# EAGLE schematic TIMESQUARE (EAGLE 6.3)
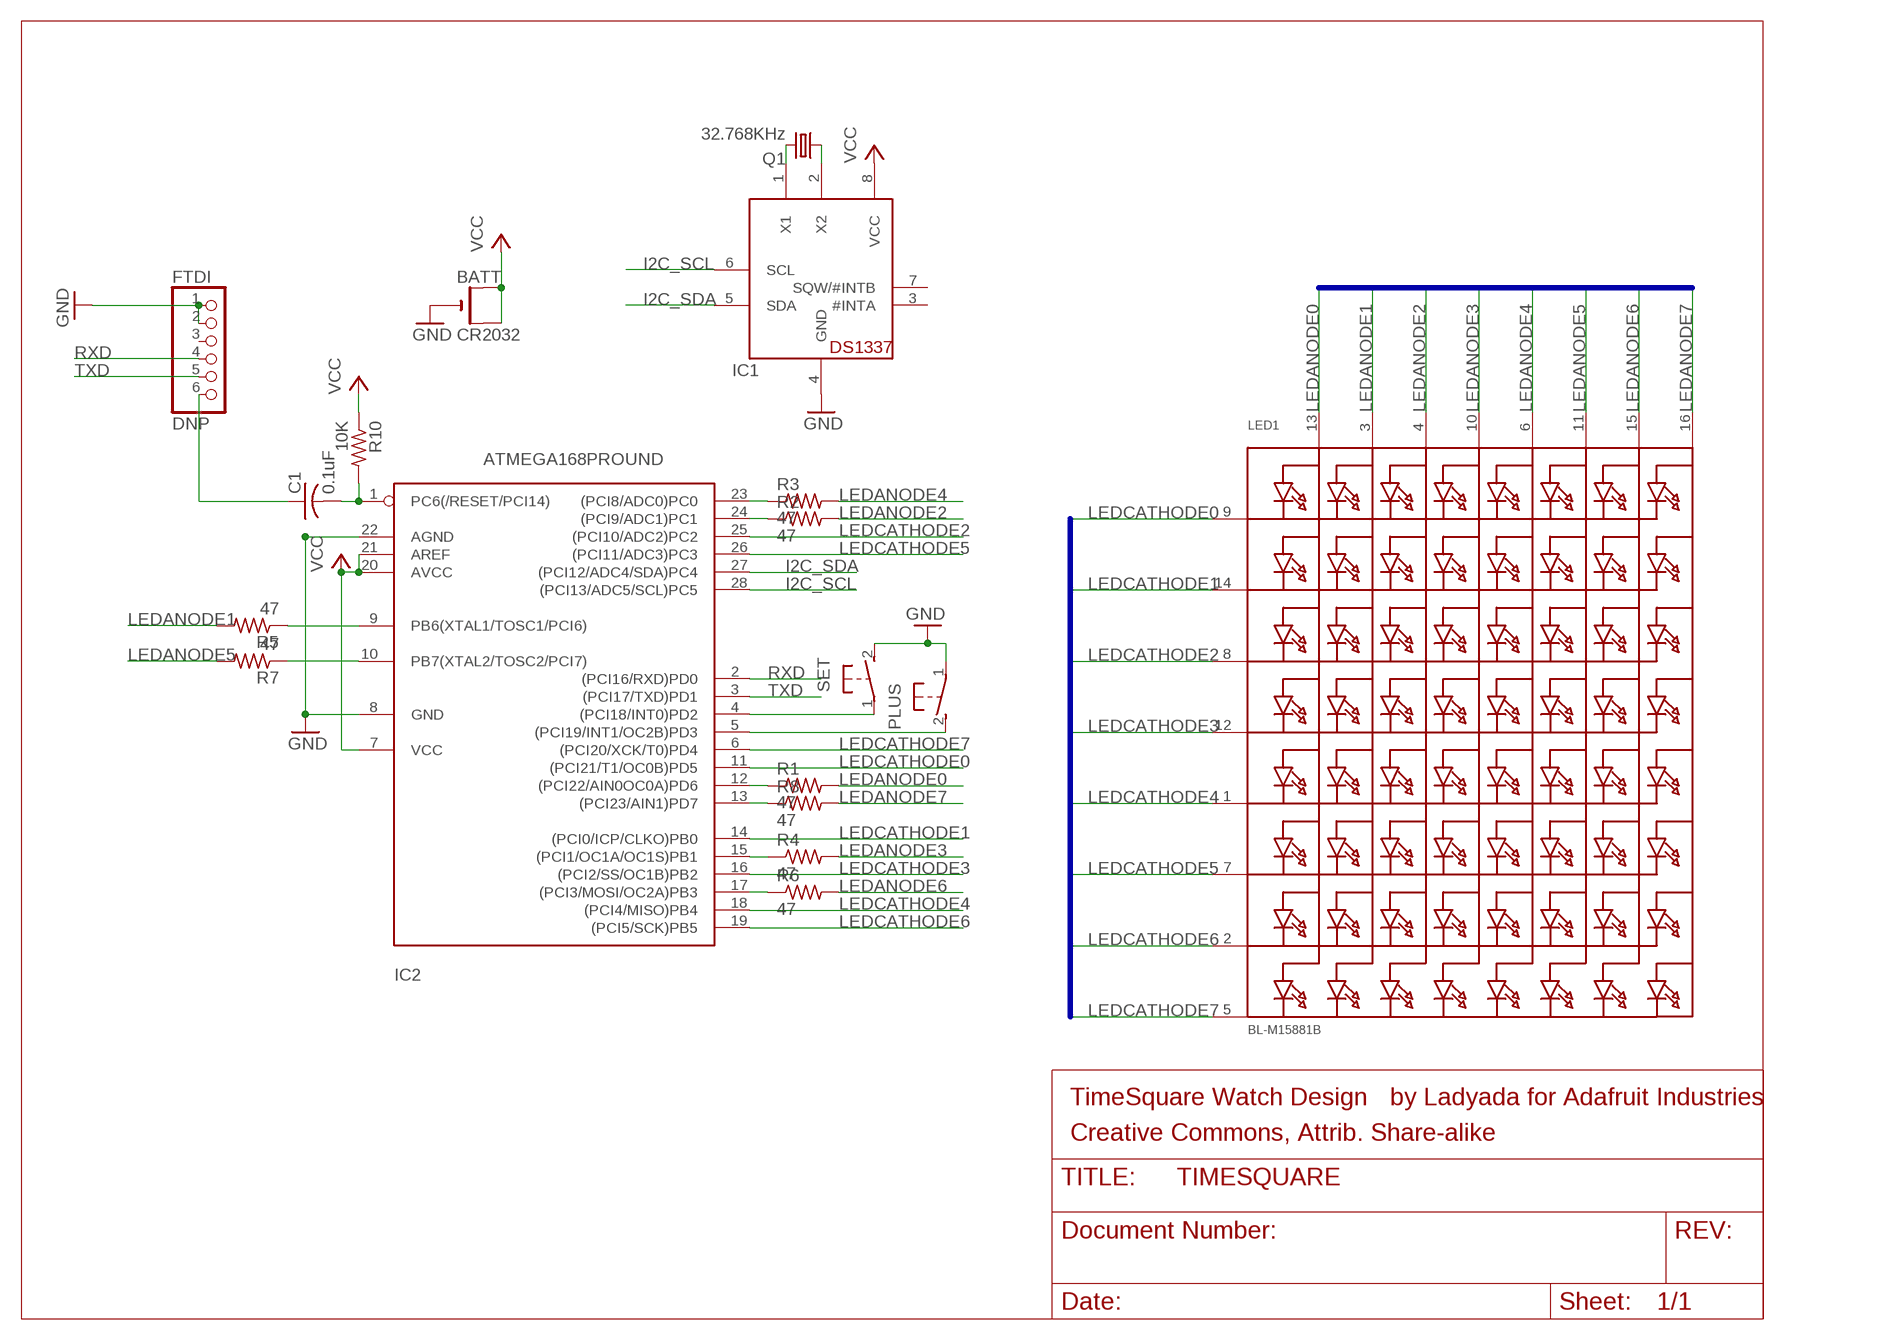
[diagram p0: schematic, sheet 1]

## Parts
BATT  CR2032  CR2032THM  [CR2032-THRU]
C1  0.1uF  C-US025-025X050  [C025-025X050]
FTDI  DNP  PINHD-1X6CLEAN  [1X06-CLEAN]
IC1  DS1337  [DIL08-ROUND]
IC2  ATMEGA168PROUND  [DIL28-3-ROUND]
LED1  BL-M15881B  SEGMENT_8X8_ROWCATHODEBL-M15  [SEGMENT_BL-M15A881]
PLUS  31-XXSKINNY  [B3F-31XX-SKINNIER]
Q1  32.768KHz  CRYSTALTC38H  [TC38H]
R1  47  R-US_0204/7  [0204/7]
R2  47  R-US_0204/7  [0204/7]
R3  47  R-US_0204/7  [0204/7]
R4  47  R-US_0204/7  [0204/7]
R5  47  R-US_0204/7  [0204/7]
R6  47  R-US_0204/7  [0204/7]
R7  47  R-US_0204/7  [0204/7]
R8  47  R-US_0204/7  [0204/7]
R10  10K  R-US_0204/7  [0204/7]
SET  31-XXSKINNY  [B3F-31XX-SKINNIER]

## Nets
GND: BATT.- FTDI.1 FTDI.2 IC1.4(GND) IC2.8(GND) IC2.22(AGND) PLUS.1(P) SET.2(S)
I2C_SCL: IC1.6(SCL) IC2.28((PCI13/ADC5/SCL)PC5)
I2C_SDA: IC1.5(SDA) IC2.27((PCI12/ADC4/SDA)PC4)
LEDANODE0: LED1.13(A1) R1.2
LEDANODE1: LED1.3(A2) R5.2
LEDANODE2: LED1.4(A3) R2.2
LEDANODE3: LED1.10(A4) R4.2
LEDANODE4: LED1.6(A5) R3.2
LEDANODE5: LED1.11(A6) R7.2
LEDANODE6: LED1.15(A7) R6.2
LEDANODE7: LED1.16(A8) R8.2
LEDCATHODE0: IC2.11((PCI21/T1/OC0B)PD5) LED1.9(K1)
LEDCATHODE1: IC2.14((PCI0/ICP/CLKO)PB0) LED1.14(K2)
LEDCATHODE2: IC2.25((PCI10/ADC2)PC2) LED1.8(K3)
LEDCATHODE3: IC2.16((PCI2/SS/OC1B)PB2) LED1.12(K4)
LEDCATHODE4: IC2.18((PCI4/MISO)PB4) LED1.1(K5)
LEDCATHODE5: IC2.26((PCI11/ADC3)PC3) LED1.7(K6)
LEDCATHODE6: IC2.19((PCI5/SCK)PB5) LED1.2(K7)
LEDCATHODE7: IC2.6((PCI20/XCK/T0)PD4) LED1.5(K8)
N$1: C1.2 IC2.1(PC6(/RESET/PCI14)) R10.2
N$2: IC1.1(X1) Q1.2
N$3: IC1.2(X2) Q1.1
N$4: IC2.4((PCI18/INT0)PD2) SET.1(P)
N$5: IC2.5((PCI19/INT1/OC2B)PD3) PLUS.2(S)
N$6: IC2.12((PCI22/AIN0OC0A)PD6) R1.1
N$7: IC2.23((PCI8/ADC0)PC0) R3.1
N$8: IC2.9(PB6(XTAL1/TOSC1/PCI6)) R5.1
N$9: IC2.10(PB7(XTAL2/TOSC2/PCI7)) R7.1
N$10: IC2.24((PCI9/ADC1)PC1) R2.1
N$11: IC2.17((PCI3/MOSI/OC2A)PB3) R6.1
N$13: IC2.13((PCI23/AIN1)PD7) R8.1
N$14: IC2.15((PCI1/OC1A/OC1S)PB1) R4.1
N$16: C1.1 FTDI.6
RXD: FTDI.4 IC2.2((PCI16/RXD)PD0)
TXD: FTDI.5 IC2.3((PCI17/TXD)PD1)
VCC: BATT.+1(+) BATT.+2(+1) IC1.8(VCC) IC2.7(VCC) IC2.20(AVCC) IC2.21(AREF) R10.1
Unconnected: FTDI.3 IC1.3(#INTA) IC1.7(SQW/#INTB)

## Buses
LEDCATHODE[0..7]
LEDANODE[0..7]

## Notes on the sheet
- TimeSquare Watch Design | by Ladyada for Adafruit Industries
- Creative Commons, Attrib. Share-alike

## Library data of the parts
BATT = adafruit:CR2032
C1 = adafruit:C-US: CAPACITOR, American symbol
FTDI = adafruit:PINHD-1X6: PIN HEADER
IC1 = adafruit:DS1337: DS1337 - Maxim RTC without battery backup
IC2 = adafruit:ATMEGA168*P: MICROCONTROLLER 16 kBytes FLASH 1 kBytes SRAM 512 Bytes EEPROM USART 8-channel 10 bit ADC
LED1 = adafruit:SEGMENT_8X8_ROWCATHODE: 8x8 LED Segment Displays: Row = Cathode 0.7" Red 8X8 Matrix, 1.9mm Round LEDs - BL-M07C881UR 1.2" Red 8x8 Matrix, 3.0mm Round LEDs - BL-M12A881UR 1.2" Red 8x8 Matrix, 3.0mm Square LEDs - BL-M12A883
PLUS SET = adafruit:31-XX: OMRON SWITCH Now with beefier pads!
Q1 = adafruit:CRYSTAL: CRYSTAL; OC_FARNELL: unknown; OC_NEWARK: unknown
R1-R8 R10 = adafruit:R-US_: RESISTOR, American symbol